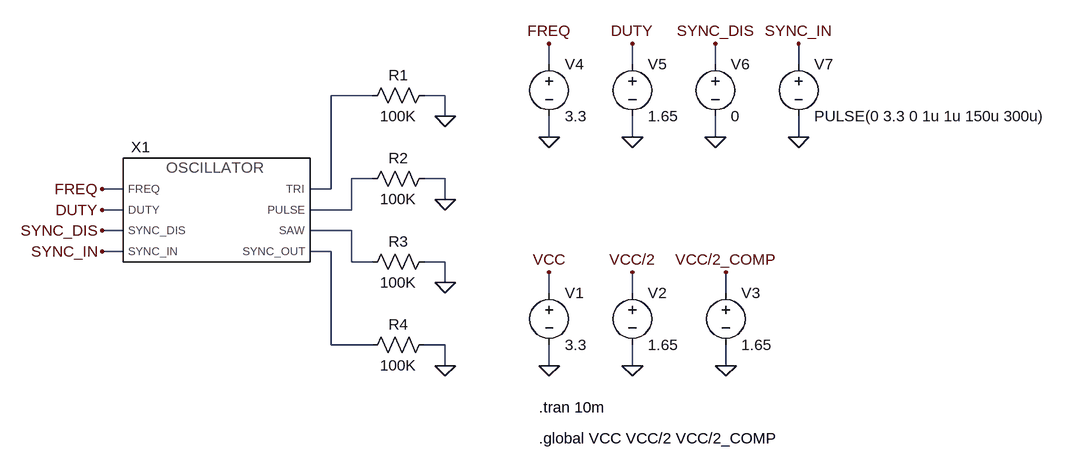
[diagram p0: schematic test_oscillator.asc]
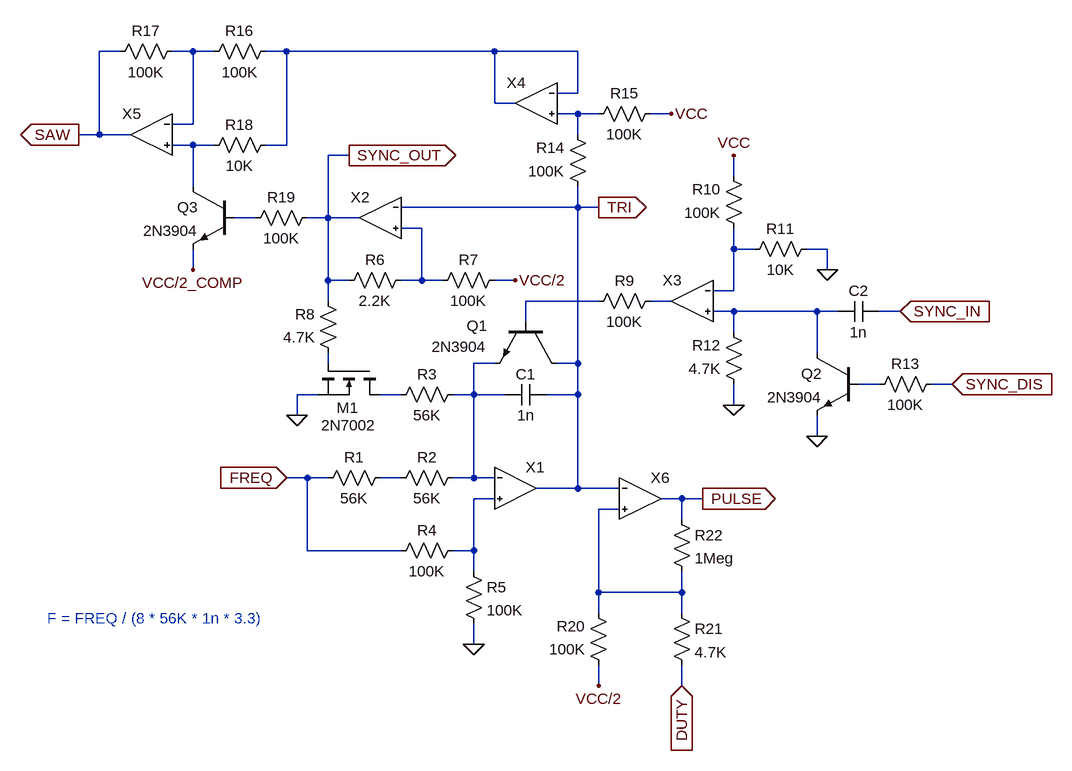
[diagram p1: sub-circuit oscillator.asc]
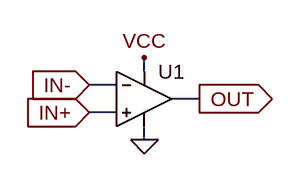
[diagram p2: sub-circuit opamp.asc]
test_oscillator.asc, the LTspice schematic file:
Version 4
SHEET 1 1908 736
WIRE 640 -32 640 -64
WIRE 768 -32 768 -64
WIRE 896 -32 896 -64
WIRE 1024 -32 1024 -64
WIRE 368 16 304 16
WIRE 480 16 448 16
WIRE 480 48 480 16
WIRE 640 80 640 48
WIRE 768 80 768 48
WIRE 896 80 896 48
WIRE 1024 80 1024 48
WIRE 368 144 336 144
WIRE 480 144 448 144
WIRE -16 160 -48 160
WIRE 304 160 304 16
WIRE 304 160 272 160
WIRE 480 176 480 144
WIRE -16 192 -48 192
WIRE 336 192 336 144
WIRE 336 192 272 192
WIRE -16 224 -48 224
WIRE 336 224 272 224
WIRE -16 256 -48 256
WIRE 304 256 272 256
WIRE 336 272 336 224
WIRE 368 272 336 272
WIRE 480 272 448 272
WIRE 480 304 480 272
WIRE 640 320 640 288
WIRE 768 320 768 288
WIRE 912 320 912 288
WIRE 304 400 304 256
WIRE 368 400 304 400
WIRE 480 400 448 400
WIRE 480 432 480 400
WIRE 640 432 640 400
WIRE 768 432 768 400
WIRE 912 432 912 400
FLAG 480 48 0
FLAG 480 176 0
FLAG 480 304 0
FLAG 640 432 0
FLAG 768 432 0
FLAG 912 432 0
FLAG 640 288 VCC
FLAG 768 288 VCC/2
FLAG 912 288 VCC/2_COMP
FLAG 480 432 0
FLAG -48 160 FREQ
FLAG -48 192 DUTY
FLAG -48 224 SYNC_DIS
FLAG 640 80 0
FLAG 640 -64 FREQ
FLAG 768 80 0
FLAG 768 -64 DUTY
FLAG 896 80 0
FLAG 896 -64 SYNC_DIS
FLAG 1024 80 0
FLAG 1024 -64 SYNC_IN
FLAG -48 256 SYNC_IN
SYMBOL oscillator 48 160 R0
WINDOW 0 -51 -65 Left 2
SYMATTR InstName X1
SYMBOL res 464 0 R90
WINDOW 0 0 56 VBottom 2
WINDOW 3 32 56 VTop 2
SYMATTR InstName R1
SYMATTR Value 100K
SYMBOL res 464 128 R90
WINDOW 0 0 56 VBottom 2
WINDOW 3 32 56 VTop 2
SYMATTR InstName R2
SYMATTR Value 100K
SYMBOL res 464 256 R90
WINDOW 0 0 56 VBottom 2
WINDOW 3 32 56 VTop 2
SYMATTR InstName R3
SYMATTR Value 100K
SYMBOL voltage 640 304 R0
WINDOW 123 0 0 Left 0
WINDOW 39 0 0 Left 0
SYMATTR InstName V1
SYMATTR Value 3.3
SYMBOL voltage 768 304 R0
WINDOW 123 0 0 Left 0
WINDOW 39 0 0 Left 0
SYMATTR InstName V2
SYMATTR Value 1.65
SYMBOL voltage 912 304 R0
WINDOW 123 0 0 Left 0
WINDOW 39 0 0 Left 0
SYMATTR InstName V3
SYMATTR Value 1.65
SYMBOL res 464 384 R90
WINDOW 0 0 56 VBottom 2
WINDOW 3 32 56 VTop 2
SYMATTR InstName R4
SYMATTR Value 100K
SYMBOL voltage 640 -48 R0
WINDOW 123 0 0 Left 0
WINDOW 39 0 0 Left 0
SYMATTR InstName V4
SYMATTR Value 3.3
SYMBOL voltage 768 -48 R0
WINDOW 123 0 0 Left 0
WINDOW 39 0 0 Left 0
SYMATTR InstName V5
SYMATTR Value 1.65
SYMBOL voltage 896 -48 R0
WINDOW 123 0 0 Left 0
WINDOW 39 0 0 Left 0
SYMATTR InstName V6
SYMATTR Value 0
SYMBOL voltage 1024 -48 R0
WINDOW 123 0 0 Left 0
WINDOW 39 0 0 Left 0
SYMATTR InstName V7
SYMATTR Value PULSE(0 3.3 0 1u 1u 150u 300u)
TEXT 624 496 Left 2 !.tran 10m
TEXT 624 544 Left 2 !.global VCC VCC/2 VCC/2_COMP

oscillator.asc, the sub-circuit schematic file:
Version 4
SHEET 1 1312 680
WIRE -1344 -544 -1376 -544
WIRE -1232 -544 -1264 -544
WIRE -1200 -544 -1232 -544
WIRE -1088 -544 -1120 -544
WIRE -768 -544 -1088 -544
WIRE -640 -544 -768 -544
WIRE -640 -480 -640 -544
WIRE -640 -480 -672 -480
WIRE -768 -464 -768 -544
WIRE -736 -464 -768 -464
WIRE -640 -448 -672 -448
WIRE -608 -448 -640 -448
WIRE -496 -448 -528 -448
WIRE -1232 -432 -1232 -544
WIRE -1232 -432 -1264 -432
WIRE -1376 -416 -1376 -544
WIRE -1376 -416 -1408 -416
WIRE -1328 -416 -1376 -416
WIRE -640 -416 -640 -448
WIRE -1232 -400 -1264 -400
WIRE -1200 -400 -1232 -400
WIRE -1088 -400 -1088 -544
WIRE -1088 -400 -1120 -400
WIRE -992 -384 -1024 -384
WIRE -400 -352 -400 -384
WIRE -1232 -336 -1232 -400
WIRE -640 -304 -640 -336
WIRE -640 -304 -912 -304
WIRE -608 -304 -640 -304
WIRE -1136 -288 -1168 -288
WIRE -1024 -288 -1024 -384
WIRE -1024 -288 -1056 -288
WIRE -976 -288 -1024 -288
WIRE -880 -272 -912 -272
WIRE -400 -240 -400 -272
WIRE -368 -240 -400 -240
WIRE -256 -240 -288 -240
WIRE -1232 -208 -1232 -240
WIRE -256 -208 -256 -240
WIRE -1024 -192 -1024 -288
WIRE -992 -192 -1024 -192
WIRE -880 -192 -880 -272
WIRE -880 -192 -912 -192
WIRE -848 -192 -880 -192
WIRE -736 -192 -768 -192
WIRE -400 -176 -400 -240
WIRE -400 -176 -432 -176
WIRE -1024 -160 -1024 -192
WIRE -608 -160 -720 -160
WIRE -496 -160 -528 -160
WIRE -400 -144 -432 -144
WIRE -272 -144 -400 -144
WIRE -240 -144 -272 -144
WIRE -144 -144 -176 -144
WIRE -720 -128 -720 -160
WIRE -400 -112 -400 -144
WIRE -272 -80 -272 -144
WIRE -1024 -64 -1024 -80
WIRE -768 -64 -800 -64
WIRE -640 -64 -640 -304
WIRE -640 -64 -672 -64
WIRE -176 -32 -208 -32
WIRE -64 -32 -96 -32
WIRE -1040 -16 -1072 -16
WIRE -912 -16 -944 -16
WIRE -800 -16 -800 -64
WIRE -800 -16 -832 -16
WIRE -752 -16 -800 -16
WIRE -640 -16 -640 -64
WIRE -640 -16 -688 -16
WIRE -400 0 -400 -32
WIRE -1072 16 -1072 -16
WIRE -272 48 -272 16
WIRE -1056 112 -1088 112
WIRE -1024 112 -1056 112
WIRE -912 112 -944 112
WIRE -800 112 -800 -16
WIRE -800 112 -832 112
WIRE -768 112 -800 112
WIRE -640 128 -640 -16
WIRE -640 128 -704 128
WIRE -576 128 -640 128
WIRE -768 144 -800 144
WIRE -480 144 -512 144
WIRE -448 144 -480 144
WIRE -576 160 -608 160
WIRE -480 176 -480 144
WIRE -1056 224 -1056 112
WIRE -912 224 -1056 224
WIRE -800 224 -800 144
WIRE -800 224 -832 224
WIRE -800 256 -800 224
WIRE -608 288 -608 160
WIRE -480 288 -480 256
WIRE -480 288 -608 288
WIRE -608 320 -608 288
WIRE -480 320 -480 288
WIRE -800 368 -800 336
WIRE -608 432 -608 400
WIRE -480 432 -480 400
FLAG -736 -192 VCC/2
FLAG -1088 112 FREQ
IOPIN -1088 112 In
FLAG -480 432 DUTY
IOPIN -480 432 In
FLAG -800 368 0
FLAG -1072 16 0
FLAG -608 -304 TRI
IOPIN -608 -304 Out
FLAG -448 144 PULSE
IOPIN -448 144 Out
FLAG -608 432 VCC/2
FLAG -496 -448 VCC
FLAG -1408 -416 SAW
IOPIN -1408 -416 Out
FLAG -1232 -208 VCC/2_COMP
FLAG -992 -384 SYNC_OUT
IOPIN -992 -384 Out
FLAG -64 -32 SYNC_DIS
IOPIN -64 -32 In
FLAG -400 0 0
FLAG -144 -144 SYNC_IN
IOPIN -144 -144 In
FLAG -256 -208 0
FLAG -400 -384 VCC
FLAG -272 48 0
SYMBOL res -928 128 R270
WINDOW 0 32 56 VTop 2
WINDOW 3 0 56 VBottom 2
SYMATTR InstName R2
SYMATTR Value 56K
SYMBOL res -896 -208 R90
WINDOW 0 0 56 VBottom 2
WINDOW 3 32 56 VTop 2
SYMATTR InstName R6
SYMATTR Value 2.2K
SYMBOL res -752 -208 R90
WINDOW 0 0 56 VBottom 2
WINDOW 3 32 56 VTop 2
SYMATTR InstName R7
SYMATTR Value 100K
SYMBOL res -816 -32 R90
WINDOW 0 0 56 VBottom 2
WINDOW 3 32 56 VTop 2
SYMATTR InstName R3
SYMATTR Value 56K
SYMBOL cap -688 -32 R90
WINDOW 0 0 32 VBottom 2
WINDOW 3 32 32 VTop 2
SYMATTR InstName C1
SYMATTR Value 1n
SYMBOL res -816 240 R0
SYMATTR InstName R5
SYMATTR Value 100K
SYMBOL res -928 240 R270
WINDOW 0 32 56 VTop 2
WINDOW 3 0 56 VBottom 2
SYMATTR InstName R4
SYMATTR Value 100K
SYMBOL nmos -944 -64 R90
WINDOW 0 68 33 VRight 2
WINDOW 3 95 6 VRight 2
SYMATTR InstName M1
SYMATTR Value 2N7002
SYMBOL res -496 304 R0
SYMATTR InstName R21
SYMATTR Value 4.7K
SYMBOL res -592 416 R180
WINDOW 0 36 76 Left 2
WINDOW 3 36 40 Left 2
SYMATTR InstName R20
SYMATTR Value 100K
SYMBOL res -1008 -64 R180
WINDOW 0 36 76 Left 2
WINDOW 3 36 40 Left 2
SYMATTR InstName R8
SYMATTR Value 4.7K
SYMBOL res -496 160 R0
SYMATTR InstName R22
SYMATTR Value 1Meg
SYMBOL res -1040 128 R270
WINDOW 0 32 56 VTop 2
WINDOW 3 0 56 VBottom 2
SYMATTR InstName R1
SYMATTR Value 56K
SYMBOL opamp -944 -288 M0
SYMATTR InstName X2
SYMBOL opamp -544 144 R0
SYMATTR InstName X6
SYMBOL opamp -736 128 R0
SYMATTR InstName X1
SYMBOL res -1248 -560 R90
WINDOW 0 0 56 VBottom 2
WINDOW 3 32 56 VTop 2
SYMATTR InstName R17
SYMATTR Value 100K
SYMBOL res -1104 -560 R90
WINDOW 0 0 56 VBottom 2
WINDOW 3 32 56 VTop 2
SYMATTR InstName R16
SYMATTR Value 100K
SYMBOL res -1104 -416 R90
WINDOW 0 0 56 VBottom 2
WINDOW 3 32 56 VTop 2
SYMATTR InstName R18
SYMATTR Value 10K
SYMBOL res -624 -320 R180
WINDOW 0 36 76 Left 2
WINDOW 3 36 40 Left 2
SYMATTR InstName R14
SYMATTR Value 100K
SYMBOL res -624 -432 R270
WINDOW 0 32 56 VTop 2
WINDOW 3 0 56 VBottom 2
SYMATTR InstName R15
SYMATTR Value 100K
SYMBOL opamp -704 -464 M0
SYMATTR InstName X4
SYMBOL opamp -1296 -416 M0
SYMATTR InstName X5
SYMBOL npn -1168 -336 M0
SYMATTR InstName Q3
SYMATTR Value 2N3904
SYMBOL res -1040 -304 R90
WINDOW 0 0 56 VBottom 2
WINDOW 3 32 56 VTop 2
SYMATTR InstName R19
SYMATTR Value 100K
SYMBOL npn -672 -128 R90
WINDOW 0 6 107 VRight 2
WINDOW 3 38 108 VRight 2
SYMATTR InstName Q1
SYMATTR Value 2N3904
SYMBOL res -512 -176 R90
WINDOW 0 0 56 VBottom 2
WINDOW 3 32 56 VTop 2
SYMATTR InstName R9
SYMATTR Value 100K
SYMBOL cap -176 -160 R90
WINDOW 0 0 32 VBottom 2
WINDOW 3 32 32 VTop 2
SYMATTR InstName C2
SYMATTR Value 1n
SYMBOL res -384 -16 R180
WINDOW 0 36 76 Left 2
WINDOW 3 36 40 Left 2
SYMATTR InstName R12
SYMATTR Value 4.7K
SYMBOL opamp -464 -160 M0
SYMATTR InstName X3
SYMBOL res -272 -256 R90
WINDOW 0 0 56 VBottom 2
WINDOW 3 32 56 VTop 2
SYMATTR InstName R11
SYMATTR Value 10K
SYMBOL res -384 -256 R180
WINDOW 0 36 76 Left 2
WINDOW 3 36 40 Left 2
SYMATTR InstName R10
SYMATTR Value 100K
SYMBOL res -80 -48 R90
WINDOW 0 0 56 VBottom 2
WINDOW 3 32 56 VTop 2
SYMATTR InstName R13
SYMATTR Value 100K
SYMBOL npn -208 -80 M0
SYMATTR InstName Q2
SYMATTR Value 2N3904
TEXT -1456 328 Left 2 ;F = FREQ / (8 * 56K * 1n * 3.3)

opamp.asc, the sub-circuit schematic file:
Version 4
SHEET 1 880 680
WIRE 144 144 144 128
WIRE 112 160 80 160
WIRE 208 176 176 176
WIRE 112 192 80 192
WIRE 144 224 144 208
FLAG 144 224 0
FLAG 144 128 VCC
FLAG 208 176 OUT
IOPIN 208 176 Out
FLAG 80 192 IN+
IOPIN 80 192 In
FLAG 80 160 IN-
IOPIN 80 160 In
SYMBOL Opamps\\UniversalOpamp2 144 176 R0
SYMATTR InstName U1
SYMATTR Value2 Avol=1Meg GBW=1.2Meg Slew=10Meg

The netlist it stands for:
* test_oscillator.asc
XX1 FREQ DUTY N001 N002 N003 SYNC_DIS SYNC_IN N004 oscillator
R1 0 N001 100K
R2 0 N002 100K
R3 0 N003 100K
V1 VCC 0 3.3
V2 VCC/2 0 1.65
V3 VCC/2_COMP 0 1.65
R4 0 N004 100K
V4 FREQ 0 3.3
V5 DUTY 0 1.65
V6 SYNC_DIS 0 0
V7 SYNC_IN 0 PULSE(0 3.3 0 1u 1u 150u 300u)

* block symbol definitions
.subckt oscillator FREQ DUTY TRI PULSE SAW SYNC_DIS SYNC_IN SYNC_OUT
R2 N015 N012 56K
R6 N006 SYNC_OUT 2.2K
R7 VCC/2 N006 100K
R3 N012 N014 56K
C1 TRI N012 1n
R5 N016 0 100K
R4 FREQ N016 100K
M1 N014 N011 0 0 2N7002
R21 N017 DUTY 4.7K
R20 VCC/2 N017 100K
R8 N011 SYNC_OUT 4.7K
R22 PULSE N017 1Meg
R1 FREQ N015 56K
XX2 N006 TRI SYNC_OUT opamp
XX6 N017 TRI PULSE opamp
XX1 N016 N012 TRI opamp
R17 N001 SAW 100K
R16 N002 N001 100K
R18 N002 N004 10K
R14 TRI N003 100K
R15 N003 VCC 100K
XX4 N003 N002 N002 opamp
XX5 N004 N001 SAW opamp
Q3 N004 N005 VCC/2_COMP 0 2N3904
R19 SYNC_OUT N005 100K
Q1 TRI N008 N012 0 2N3904
R9 N009 N008 100K
C2 SYNC_IN N010 1n
R12 0 N010 4.7K
XX3 N010 N007 N009 opamp
R11 0 N007 10K
R10 N007 VCC 100K
R13 SYNC_DIS N013 100K
Q2 N010 N013 0 0 2N3904
* F = FREQ / (8 * 56K * 1n * 3.3)
.ends oscillator

.subckt opamp IN+ IN- OUT
XU1 IN+ IN- VCC 0 OUT level.2 Avol=1Meg GBW=1.2Meg Slew=10Meg ilimit=25m rail=0 Vos=0 phimargin=45 en=0 enk=0 in=0 ink=0 Rin=500Meg  ; pins IN+ IN- V+ V- OUT
.ends opamp

.model NPN NPN
.model PNP PNP
.lib standard.bjt
.model NMOS NMOS
.model PMOS PMOS
.lib standard.mos
.tran 10m
.global VCC VCC/2 VCC/2_COMP
.lib UniversalOpamps2.sub
.backanno
.end